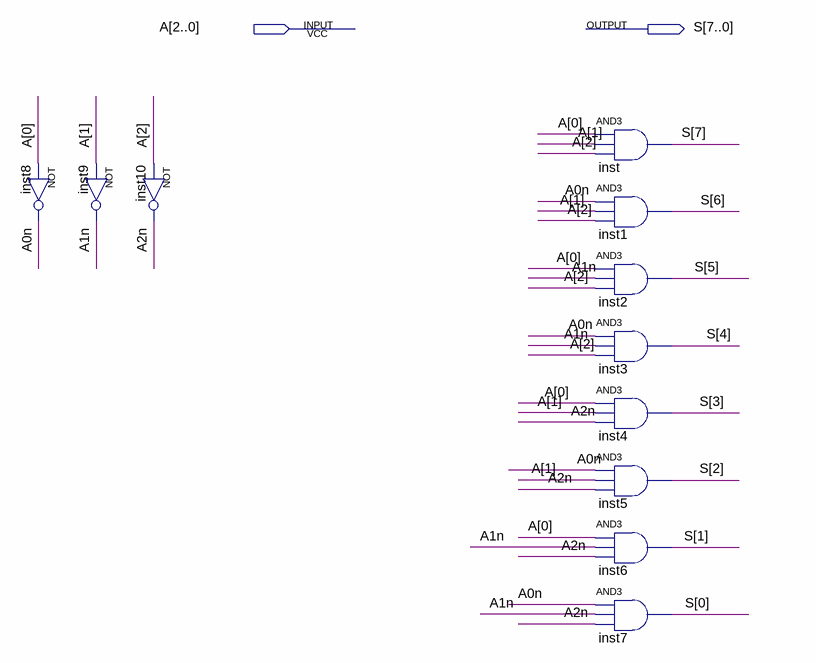
[diagram p0: schematic sheet]
// Quartus schematic DEC.bdf as structural Verilog: 11 symbols, 2 pins
module DEC (
  input  [2:0] A,
  output [7:0] S
);

  wire A0n, A1n, A2n;

  not inst8 (A0n, A[0]);
  not inst9 (A1n, A[1]);
  not inst10 (A2n, A[2]);
  and inst (S[7], A[0], A[1], A[2]);
  and inst1 (S[6], A0n, A[1], A[2]);
  and inst2 (S[5], A[0], A1n, A[2]);
  and inst3 (S[4], A0n, A1n, A[2]);
  and inst4 (S[3], A[0], A[1], A2n);
  and inst5 (S[2], A0n, A[1], A2n);
  and inst6 (S[1], A[0], A1n, A2n);
  and inst7 (S[0], A0n, A1n, A2n);
endmodule
